# EAGLE schematic uBridge2.0 (EAGLE 6.2)

## Sheet 1 of 2
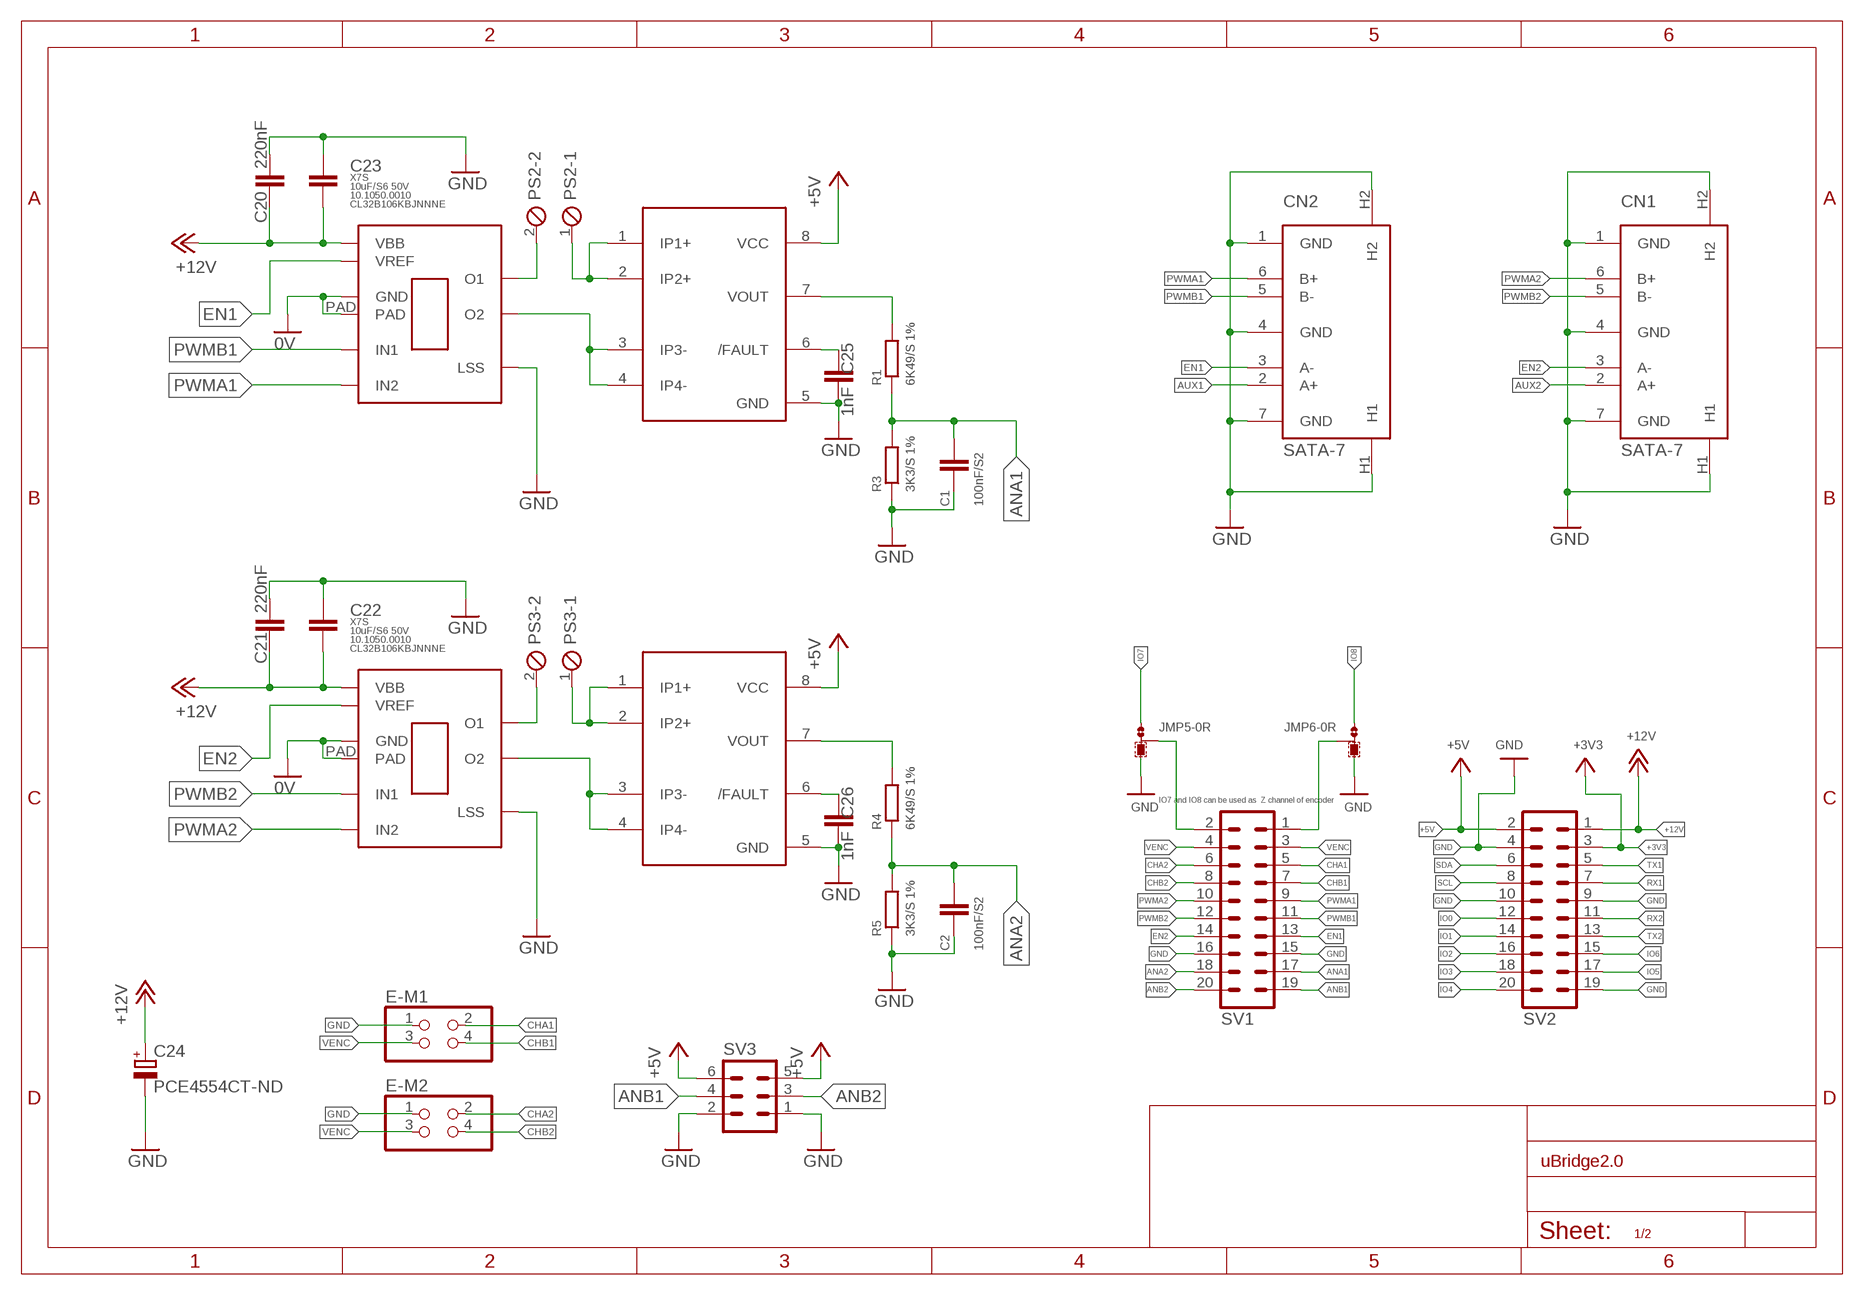
[diagram p0: schematic, sheet 1]

### Parts
C1  100nF/S2  C-EUC0603  [C0603]
C2  100nF/S2  C-EUC0603  [C0603]
C20  220nF  C-EUC0805K  [C0805K]
C21  220nF  C-EUC0805K  [C0805K]
C22  10uF/S6 50V  C-EUC3225  [C3225]
C23  10uF/S6 50V  C-EUC3225  [C3225]
C24  PCE4554CT-ND  CPOL-EUUD-6,3X7,7  [UD-6,3X7,7_NICHICON]
C25  1nF  C-EUC0805K  [C0805K]
C26  1nF  C-EUC0805K  [C0805K]
CN1  SATA-7  [SATA-5607-5102-SH]
CN2  SATA-7  [SATA-5607-5102-SH]
E-M1  PINHD-2X2  [2X02]
E-M2  PINHD-2X2  [2X02]
JMP5  0R-JUMPC  [C0R-JMP]
JMP6  0R-JUMPC  [C0R-JMP]
PS2  MPT2  [2POL254]
PS3  MPT2  [2POL254]
R1  6K49/S 1%  R-EU_R0603  [R0603]
R3  3K3/S 1%  R-EU_R0603  [R0603]
R4  6K49/S 1%  R-EU_R0603  [R0603]
R5  3K3/S 1%  R-EU_R0603  [R0603]
SV1  MA10-2  [MA10-2]
SV2  MA10-2  [MA10-2]
SV3  MA03-2  [MA03-2]
U$2  A4950  [SOICN]
U$3  A4950  [SOICN]
U$4  ACS723  ACS711  [SO08]
U$5  ACS723  ACS711  [SO08]

### Nets
+3V3: SV2.3
+5V: SV2.2 SV3.5 SV3.6 U$4.8(VCC) U$5.8(VCC) ; also sheet 2
+12V: C20.2 C21.2 C22.2 C23.2 C24.+ SV2.1 U$2.5VCC(VBB) U$3.5VCC(VBB) ; also sheet 2
ANA1: C1.1 R1.1 R3.2 SV1.17
ANA2: C2.1 R4.1 R5.2 SV1.18
ANB1: SV1.19 SV3.4
ANB2: SV1.20 SV3.3
AUX1: CN2.2(A+)
AUX2: CN1.2(A+)
CHA1: E-M1.2 SV1.5
CHA2: E-M2.2 SV1.6
CHB1: E-M1.4 SV1.7
CHB2: E-M2.4 SV1.8
EN1: CN2.3(A-) SV1.13 U$2.4CS(VREF)
EN2: CN1.3(A-) SV1.14 U$3.4CS(VREF)
GND: C1.2 C2.2 C20.1 C21.1 C22.1 C23.1 C24.- C25.2 C26.2 CN1.1(GND) CN1.4(GND) CN1.7(GND) CN1.H1 CN1.H2 CN2.1(GND) CN2.4(GND) CN2.7(GND) CN2.H1 CN2.H2 E-M1.1 E-M2.1 JMP5.3 JMP6.3 R3.1 R5.1 SV1.15 SV1.16 SV2.4 SV2.9 SV2.10 SV2.19 SV3.1 SV3.2 U$2.1VIN(GND) U$2.7BOOT(LSS) U$2.PAD U$3.1VIN(GND) U$3.7BOOT(LSS) U$3.PAD U$4.5(GND) U$5.5(GND) ; supply symbol labelled 0V ; also sheet 2
IO0: SV2.12
IO1: SV2.14
IO2: SV2.16
IO3: SV2.18
IO4: SV2.20
IO5: SV2.17
IO6: SV2.15
IO7: JMP5.1
IO8: JMP6.1
N$1: R1.2 U$4.7(VOUT)
N$2: R4.2 U$5.7(VOUT)
N$10: JMP5.2 SV1.2
N$14: U$2.8SW(O2) U$4.3(IP3-) U$4.4(IP4-)
N$19: U$3.8SW(O2) U$5.3(IP3-) U$5.4(IP4-)
N$20: PS2.1 U$4.1(IP1+) U$4.2(IP2+)
N$23: JMP6.2 SV1.1
N$24: PS3.1 U$5.1(IP1+) U$5.2(IP2+)
N$25: PS2.2 U$2.6GND(O1)
N$26: PS3.2 U$3.6GND(O1)
N$27: C25.1 U$4.6(/FAULT)
N$28: C26.1 U$5.6(/FAULT)
PWMA1: CN2.6(B+) SV1.9 U$2.2TON(IN2)
PWMA2: CN1.6(B+) SV1.10 U$3.2TON(IN2)
PWMB1: CN2.5(B-) SV1.11 U$2.3EN(IN1)
PWMB2: CN1.5(B-) SV1.12 U$3.3EN(IN1)
RX1: SV2.7
RX2: SV2.11
SCL: SV2.8
SDA: SV2.6
TX1: SV2.5
TX2: SV2.13
VENC: E-M1.3 E-M2.3 SV1.3 SV1.4

### Notes on the sheet
- IO7 and IO8 can be used as  Z channel of encoder

## Sheet 2 of 2
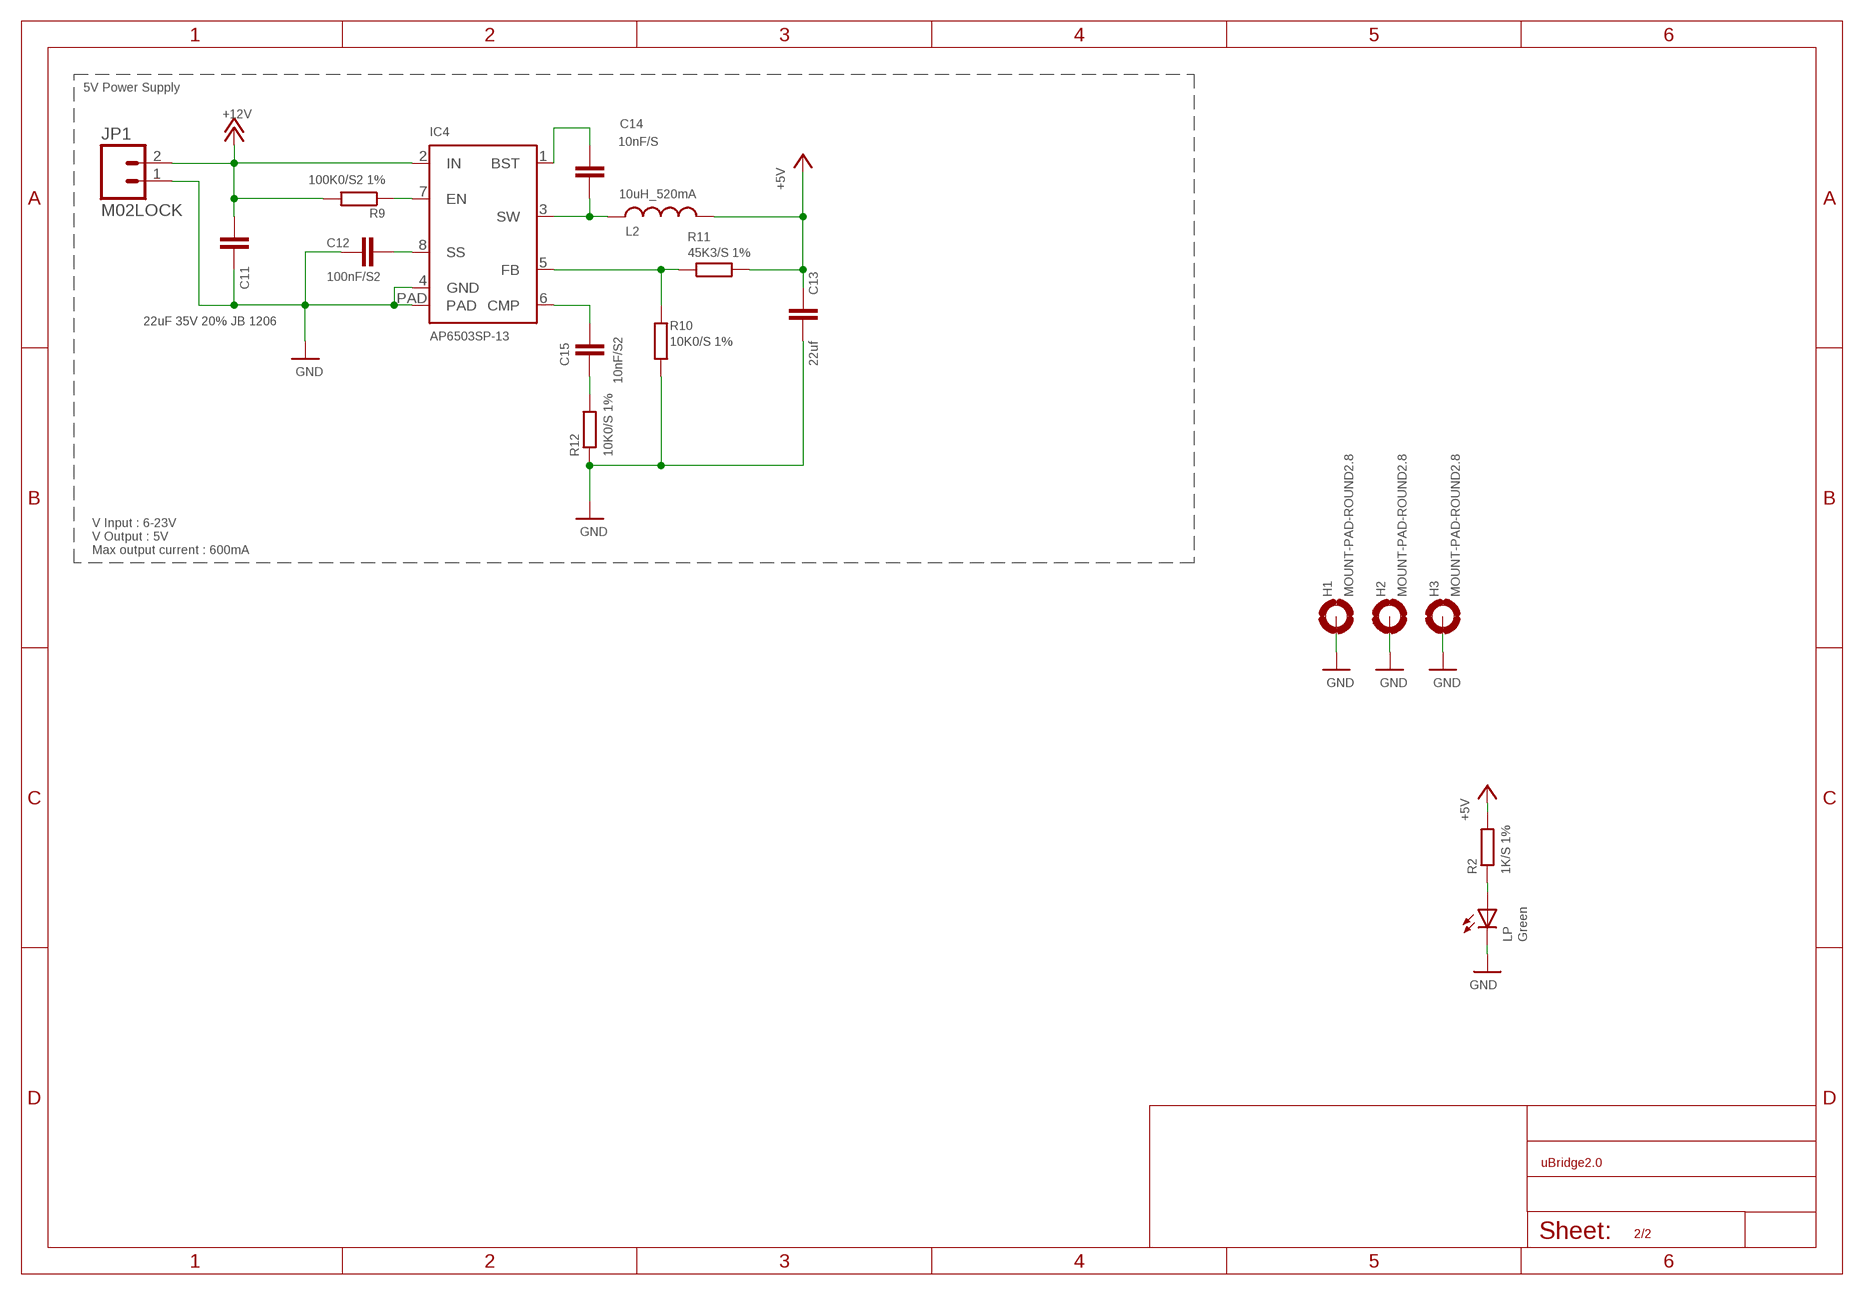
[diagram p1: schematic, sheet 2]

### Parts
C11  22uF 35V 20% JB 1206  C-EUC1206  [C1206]
C12  100nF/S2  C-EUC0603  [C0603]
C13  22uf  C-EUC1206  [C1206]
C14  10nF/S  C-EUC0603  [C0603]
C15  10nF/S2  C-EUC0603  [C0603]
H1  MOUNT-PAD-ROUND2.8  [2,8-PAD]
H2  MOUNT-PAD-ROUND2.8  [2,8-PAD]
H3  MOUNT-PAD-ROUND2.8  [2,8-PAD]
IC4  AP6503SP-13  AP6503SP-13'SO-8EP'  [SO-8EP]
JP1  M02LOCK  [1X02_LOCK]
L2  10uH_520mA  INDUCTOR1210  [1210]
LP  Green  LEDCHIPLED_0805  [CHIPLED_0805]
R2  1K/S 1%  R-EU_R0603  [R0603]
R9  100K0/S2 1%  R-EU_R0603  [R0603]
R10  10K0/S 1%  R-EU_R0603  [R0603]
R11  45K3/S 1%  R-EU_R0603  [R0603]
R12  10K0/S 1%  R-EU_R0603  [R0603]

### Nets
+5V: C13.1 L2.2 R2.2 R11.2 ; also sheet 1
+12V: C11.1 IC4.2(IN) JP1.2 R9.2 ; also sheet 1
GND: C11.2 C12.2 C13.2 H1.B2,8(MOUNT) H2.B2,8(MOUNT) H3.B2,8(MOUNT) IC4.4(GND) IC4.PAD JP1.1 LP.C R10.2 R12.1 ; also sheet 1
N$4: C14.1 IC4.1(BST)
N$5: LP.A R2.1
N$6: IC4.7(EN) R9.1
N$8: C12.1 IC4.8(SS)
N$9: IC4.5(FB) R10.1 R11.1
N$15: C14.2 IC4.3(SW) L2.1
N$16: C15.1 IC4.6(CMP)
N$17: C15.2 R12.2

### Notes on the sheet
- 5V Power Supply
- V Input : 6-23V
  V Output : 5V
  Max output current : 600mA

## Library data of the parts
C1 C2 C11-C15 C20 C21 C25 C26 = rcl:C-EU: CAPACITOR, European symbol
C22 C23 = rcl:C-EU: CAPACITOR, European symbol; CASE: C3225 [EIA CC1210]; CODE: CL32B106KBJNNNE; KATODO: 10.1050.0010; TEMPERATURE: X7S
C24 = rcl:CPOL-EU: POLARIZED CAPACITOR, European symbol
CN1 CN2 = OfficineRobotiche:SATA-7
E-M1 E-M2 = pinhead:PINHD-2X2: PIN HEADER
H1-H3 = holes:MOUNT-PAD-ROUND: MOUNTING PAD, round
IC4 = OfficineRobotiche:AP6503SP-13: 340kHz 23V 3A SYNCHRONOUS DC/DC BUCK CONVERTER
JMP5 JMP6 = jump-0r-smd:0R-JUMP: SMD 0R 0805 Jumper
JP1 = SparkFun-Connectors:M02: Standard 2-pin 0.1" header. Use with - straight break away headers ( PRT-00116) - right angle break away headers (PRT-00553) - swiss pins (PRT-00743) - machine pins (PRT-00117) - female headers (PRT-00115) Molex polarized connector foot print use with: PRT-08233 with associated crimp pins and housings. 2.54_SCREWTERM for use with PRT-10571. 3.5mm Screw Terminal footprints for PRT-08084 5mm Screw Terminal footprints for use with PRT-08433
L2 = SparkFun-Passives:INDUCTOR: Inductors Basic Inductor/Choke - 0603 and 1206. Footprints are not proven and vary greatly between part numbers. SRN6045- 33uH, 20% 1.4A SDR0403-560KL - 56uH, 10%, 500mA RMS/740mA peak
LP = led:LED: LED OSRAM: - CHIPLED LG R971, LG N971, LY N971, LG Q971, LY Q971, LO R971, LY R971 LH N974, LH R974 LS Q976, LO Q976, LY Q976 LO Q996 - Hyper CHIPLED LW Q18S LB Q993, LB Q99A, LB R99A - SideLED LS A670, LO A670, LY A670, LG A670, LP A670 LB A673, LV A673, LT A673, LW A673 LH A674 LY A675 LS A676, LA A676, LO A676, LY A676, LW A676 LS A679, LY A679, LG A679 - Hyper Micro SIDELED® LS Y876, LA Y876, LO Y876, LY Y876 LT Y87S - SmartLED LW L88C, LW L88S LB L89C, LB L89S, LG L890 LS L89K, LO L89K, LY L89K LS L896, LA L896, LO L896, LY L896 - TOPLED LS T670, LO T670, LY T670, LG T670, LP T670 LSG T670, LSP T670, LSY T670, LOP T670, LYG T670 LG T671, LOG T671, LSG T671 LB T673, LV T673, LT T673, LW T673 LH T674 LS T676, LA T676, LO T676, LY T676, LB T676, LH T676, LSB T676, LW T676 LB T67C, LV T67C, LT T67C, LS T67K, LO T67K, LY T67K, LW E67C LS E67B, LA E67B, LO E67B, LY E67B, LB E67C, LV E67C, LT E67C LW T67C LS T679, LY T679, LG T679 LS T770, LO T770, LY T770, LG T770, LP T770 LB T773, LV T773, LT T773, LW T773 LH T774 LS E675, LA E675, LY E675, LS T675 LS T776, LA T776, LO T776, LY T776, LB T776 LHGB T686 LT T68C, LB T68C - Hyper Mini TOPLED® LB M676 - Mini TOPLED Santana® LG M470 LS M47K, LO M47K, LY M47K Source: http://www.osram.convergy.de LUXEON: - LUMILED® LXK2-PW12-R00, LXK2-PW12-S00, LXK2-PW14-U00, LXK2-PW14-V00 LXK2-PM12-R00, LXK2-PM12-S00, LXK2-PM14-U00 LXK2-PE12-Q00, LXK2-PE12-R00, LXK2-PE12-S00, LXK2-PE14-T00, LXK2-PE14-U00 LXK2-PB12-K00, LXK2-PB12-L00, LXK2-PB12-M00, LXK2-PB14-N00, LXK2-PB14-P00, LXK2-PB14-Q00 LXK2-PR12-L00, LXK2-PR12-M00, LXK2-PR14-Q00, LXK2-PR14-R00 LXK2-PD12-Q00, LXK2-PD12-R00, LXK2-PD12-S00 LXK2-PH12-R00, LXK2-PH12-S00 LXK2-PL12-P00, LXK2-PL12-Q00, LXK2-PL12-R00 Source: www.luxeon.com KINGBRIGHT: KA-3528ASYC Source: www.kingbright.com
PS2 PS3 = Personale:MPT2: PHOENIX CONNECTOR
R1-R5 R9-R12 = rcl:R-EU_: RESISTOR, European symbol
SV1 SV2 = con-lstb:MA10-2: PIN HEADER; OC_FARNELL: unknown; OC_NEWARK: unknown
SV3 = con-lstb:MA03-2: PIN HEADER; OC_FARNELL: unknown; OC_NEWARK: unknown
U$2 U$3 = allegro:A4950
U$4 U$5 = allegro:ACS711

## Net classes
0 default: width 0.254 mm, drill 0.406 mm, clearance 0.178 mm
1 power: width 0.305 mm, drill 0.406 mm, clearance 0.203 mm